# EAGLE design LB_BIT_i37_mix_v03(3_5) (EAGLE 6.6.0)
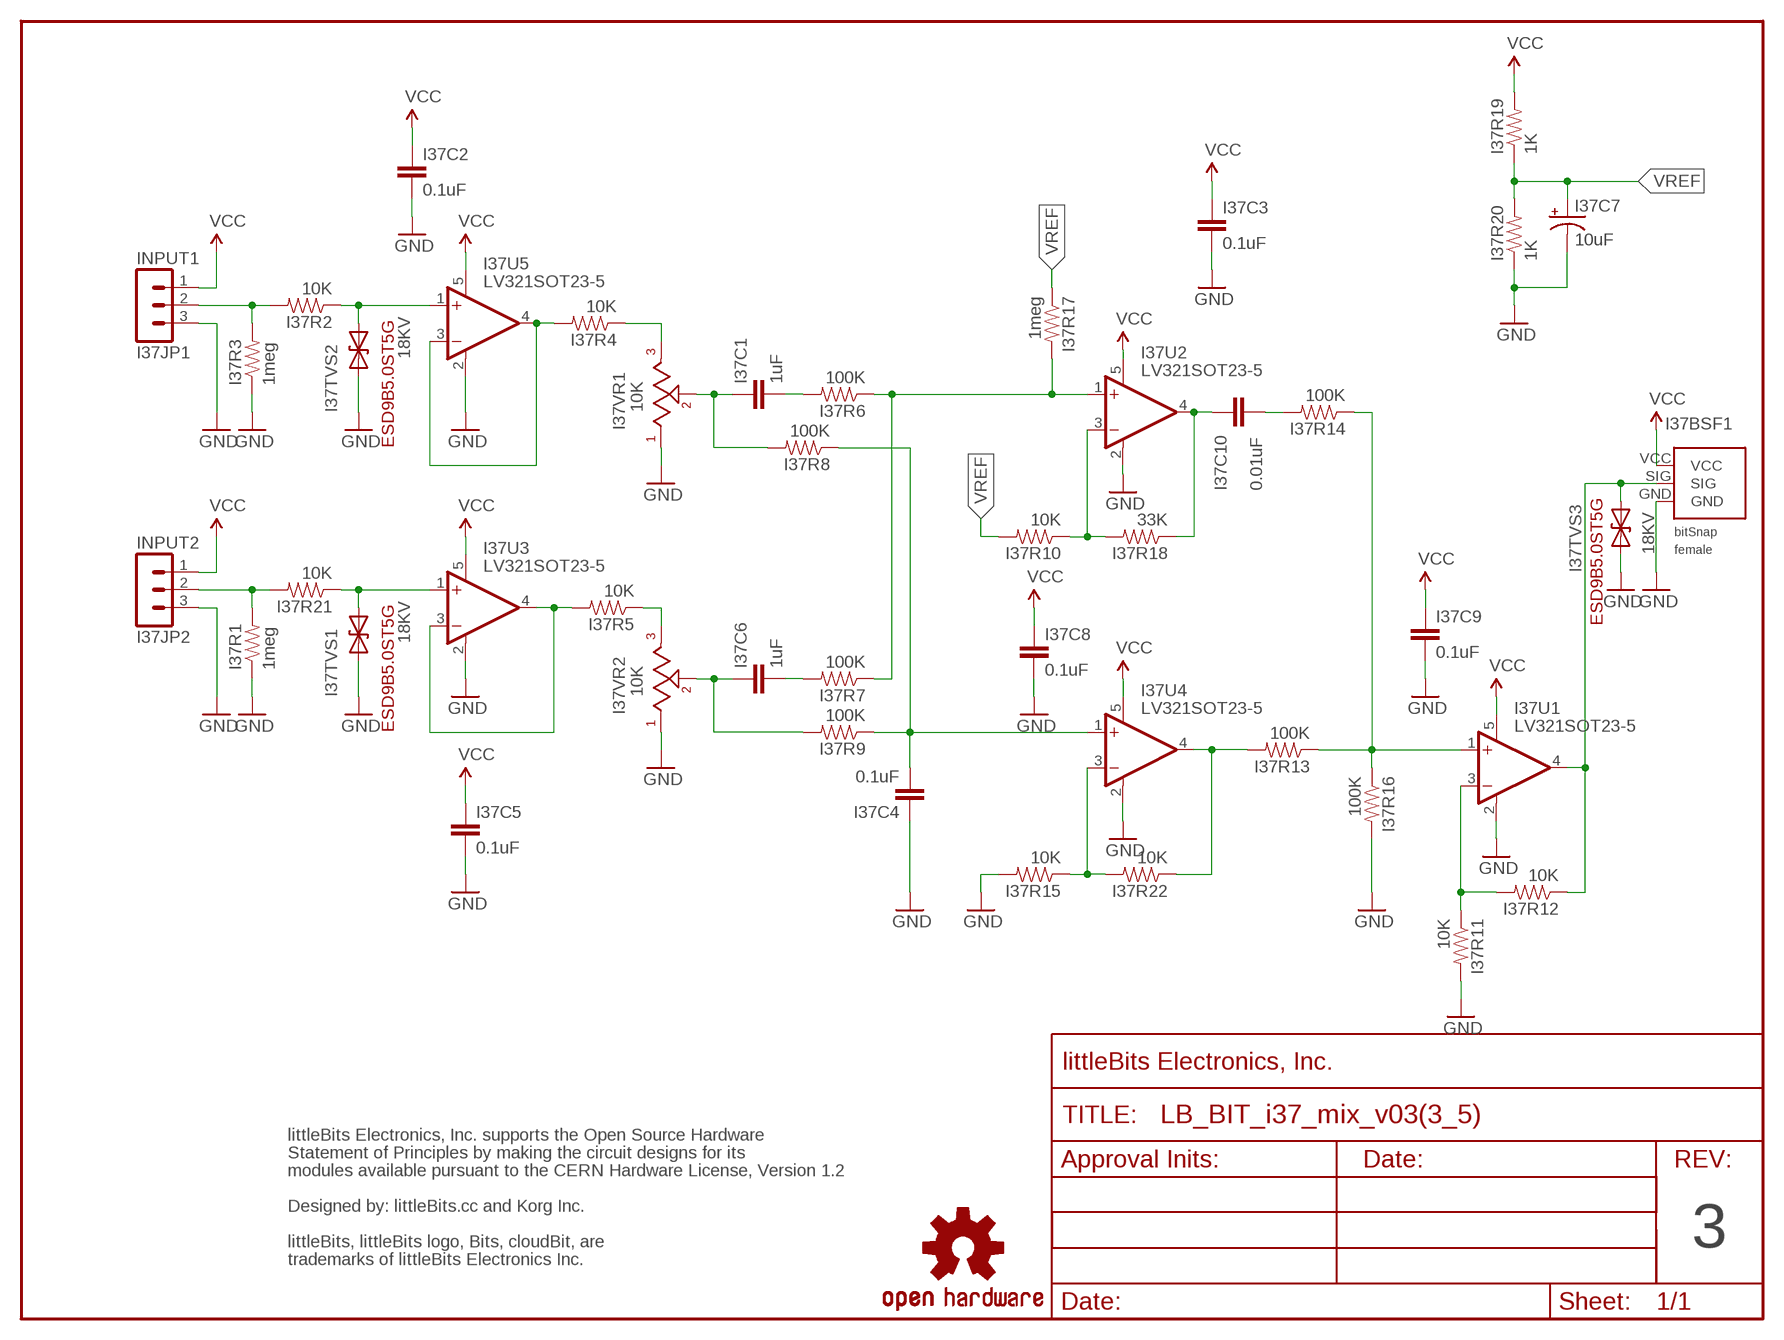
[diagram p0: schematic, sheet 1]

## Parts
I37BSF1  BITSNAP_V03_FEMALE  [BITSNAP_V03_FEMALE]
I37C1  1uF  CAPCAP-0603  [CAP-0603]
I37C2  0.1uF  CAPCAP-0603  [CAP-0603]
I37C3  0.1uF  CAPCAP-0603  [CAP-0603]
I37C4  0.1uF  CAPCAP-0603  [CAP-0603]
I37C5  0.1uF  CAPCAP-0603  [CAP-0603]
I37C6  1uF  CAPCAP-0603  [CAP-0603]
I37C7  10uF  CAP_POL3216  [EIA3216]
I37C8  0.1uF  CAPCAP-0603  [CAP-0603]
I37C9  0.1uF  CAPCAP-0603  [CAP-0603]
I37C10  0.01uF  CAPCAP-0603  [CAP-0603]
I37JP1  INPUT1  MA03-1SMD  [1X03-1MM-RA]
I37JP2  INPUT2  MA03-1SMD  [1X03-1MM-RA]
I37R1  1meg  RESISTOR0603  [RES-0603]
I37R2  10K  RESISTOR0603  [RES-0603]
I37R3  1meg  RESISTOR0603  [RES-0603]
I37R4  10K  RESISTOR0603  [RES-0603]
I37R5  10K  RESISTOR0603  [RES-0603]
I37R6  100K  RESISTOR0603  [RES-0603]
I37R7  100K  RESISTOR0603  [RES-0603]
I37R8  100K  RESISTOR0603  [RES-0603]
I37R9  100K  RESISTOR0603  [RES-0603]
I37R10  10K  RESISTOR0603  [RES-0603]
I37R11  10K  RESISTOR0603  [RES-0603]
I37R12  10K  RESISTOR0603  [RES-0603]
I37R13  100K  RESISTOR0603  [RES-0603]
I37R14  100K  RESISTOR0603  [RES-0603]
I37R15  10K  RESISTOR0603  [RES-0603]
I37R16  100K  RESISTOR0603  [RES-0603]
I37R17  1meg  RESISTOR0603  [RES-0603]
I37R18  33K  RESISTOR0603  [RES-0603]
I37R19  1K  RESISTOR0603  [RES-0603]
I37R20  1K  RESISTOR0603  [RES-0603]
I37R21  10K  RESISTOR0603  [RES-0603]
I37R22  10K  RESISTOR0603  [RES-0603]
I37TVS1  18KV  DIODE-TVSSOD-923  [SOD-923]
I37TVS2  18KV  DIODE-TVSSOD-923  [SOD-923]
I37TVS3  18KV  DIODE-TVSSOD-923  [SOD-923]
I37U1  LV321SOT23-5  [SOT23-5]
I37U2  LV321SOT23-5  [SOT23-5]
I37U3  LV321SOT23-5  [SOT23-5]
I37U4  LV321SOT23-5  [SOT23-5]
I37U5  LV321SOT23-5  [SOT23-5]
I37VR1  10K  ALPS_POTTH  [ALPS_POT]
I37VR2  10K  ALPS_POTTH  [ALPS_POT]
U$1  OSHWCREDIT-KORG  [OSHWCREDIT-KORG]
U$2  FRAME-LETTER-OHWOHW  [FABDWG01-OHW]
U$19  OSHW-LOGOL  [OSHW-LOGO-L]

## Nets
GND: I37BSF1.GND I37C2.2 I37C3.2 I37C4.1 I37C5.2 I37C7.- I37C8.2 I37C9.2 I37JP1.3 I37JP2.3 I37R1.1 I37R3.1 I37R11.2 I37R15.2 I37R16.2 I37R20.1 I37TVS1.1(A) I37TVS2.1(A) I37TVS3.1(A) I37U1.2(V-) I37U2.2(V-) I37U3.2(V-) I37U4.2(V-) I37U5.2(V-) I37VR1.1 I37VR2.1
N$1: I37JP2.2 I37R1.2 I37R21.2
N$2: I37R5.2 I37U3.3(-IN) I37U3.4(OUT)
N$3: I37JP1.2 I37R2.2 I37R3.2
N$4: I37R21.1 I37TVS1.2(C) I37U3.1(+IN)
N$5: I37R4.1 I37VR1.3
N$6: I37R2.1 I37TVS2.2(C) I37U5.1(+IN)
N$7: I37R4.2 I37U5.3(-IN) I37U5.4(OUT)
N$8: I37C1.1 I37R8.2 I37VR1.2
N$9: I37R5.1 I37VR2.3
N$10: I37C6.1 I37R9.2 I37VR2.2
N$11: I37C6.2 I37R7.2
N$12: I37C1.2 I37R6.2
N$13: I37C4.2 I37R8.1 I37R9.1 I37U4.1(+IN)
N$14: I37R6.1 I37R7.1 I37R17.2 I37U2.1(+IN)
N$15: I37R10.1 I37R18.2 I37U2.3(-IN)
N$16: I37C10.1 I37R18.1 I37U2.4(OUT)
N$17: I37R15.1 I37R22.2 I37U4.3(-IN)
N$18: I37R13.2 I37R22.1 I37U4.4(OUT)
N$19: I37R13.1 I37R14.1 I37R16.1 I37U1.1(+IN)
N$20: I37R11.1 I37R12.2 I37U1.3(-IN)
N$21: I37BSF1.SIG I37R12.1 I37TVS3.2(C) I37U1.4(OUT)
N$22: I37C10.2 I37R14.2
VCC: I37BSF1.VCC I37C2.1 I37C3.1 I37C5.1 I37C8.1 I37C9.1 I37JP1.1 I37JP2.1 I37R19.2 I37U1.5(V+) I37U2.5(V+) I37U3.5(V+) I37U4.5(V+) I37U5.5(V+)
VREF: I37C7.+ I37R10.2 I37R17.1 I37R19.1 I37R20.2

## Notes on the sheet
- 3

## Library data of the parts
I37BSF1 = bitSnap:BITSNAP_V03_FEMALE
I37C1-I37C6 I37C8-I37C10 = LITTLEBITS:CAP
I37C7 = LITTLEBITS:CAP_POL
I37JP1 I37JP2 = LITTLEBITS:MA03-1: PIN HEADER
I37R1-I37R22 = LITTLEBITS:RESISTOR
I37TVS1-I37TVS3 = LITTLEBITS:DIODE-TVS: Bidirectional Transient Voltage Suppression Diode: Device conducts in avalanche mode after reaching a part dependent voltage threshold. Used for limiting voltage spikes on ESD sensitive inputs and outputs.; IEC_ESD_PROT0: +/-18kV; LB_PN: ?; MPN: ESD9B5.0ST5G; V_CLAMP: ?; V_OPERATION: 5V
I37U1-I37U5 = LITTLEBITS:LV321
I37VR1 I37VR2 = LITTLEBITS:ALPS_POT
U$1 = LITTLEBITS:OSHWCREDIT-KORG
U$2 = LITTLEBITS:FRAME-LETTER-OHW
U$19 = SparkFun_NEW:OSHW-LOGO: Open Source Hardware Logo This logo indicates the piece of hardware it is found on incorporates a OSHW license and/or adheres to the definition of open source hardware found here: http://freedomdefined.org/OSHW

## Board
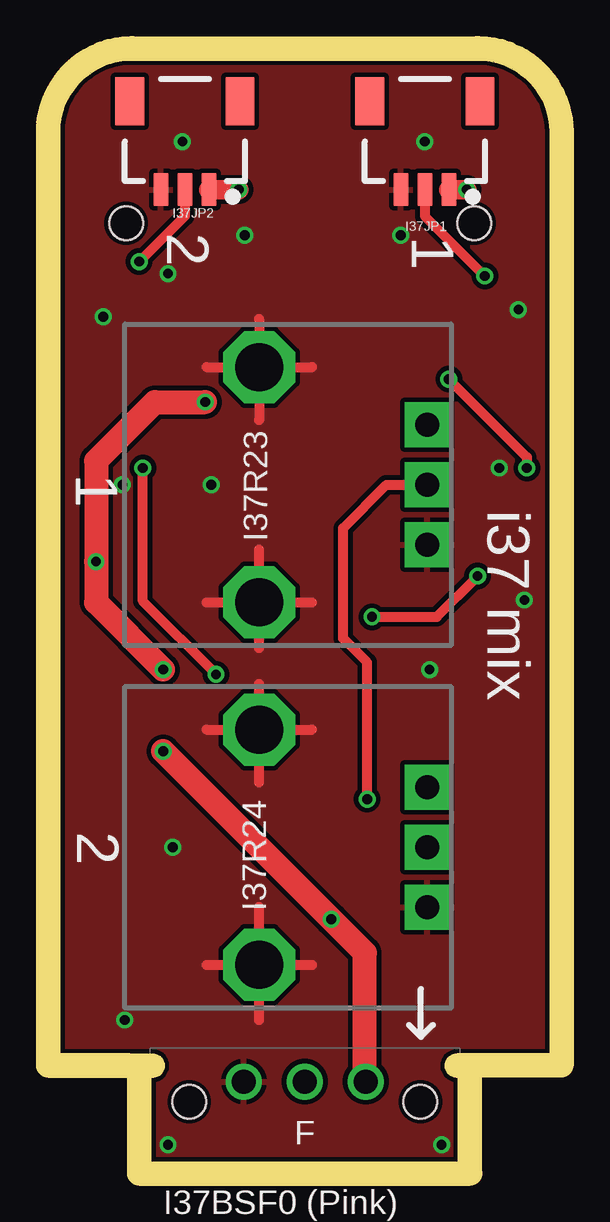
[diagram p1: board, top side]
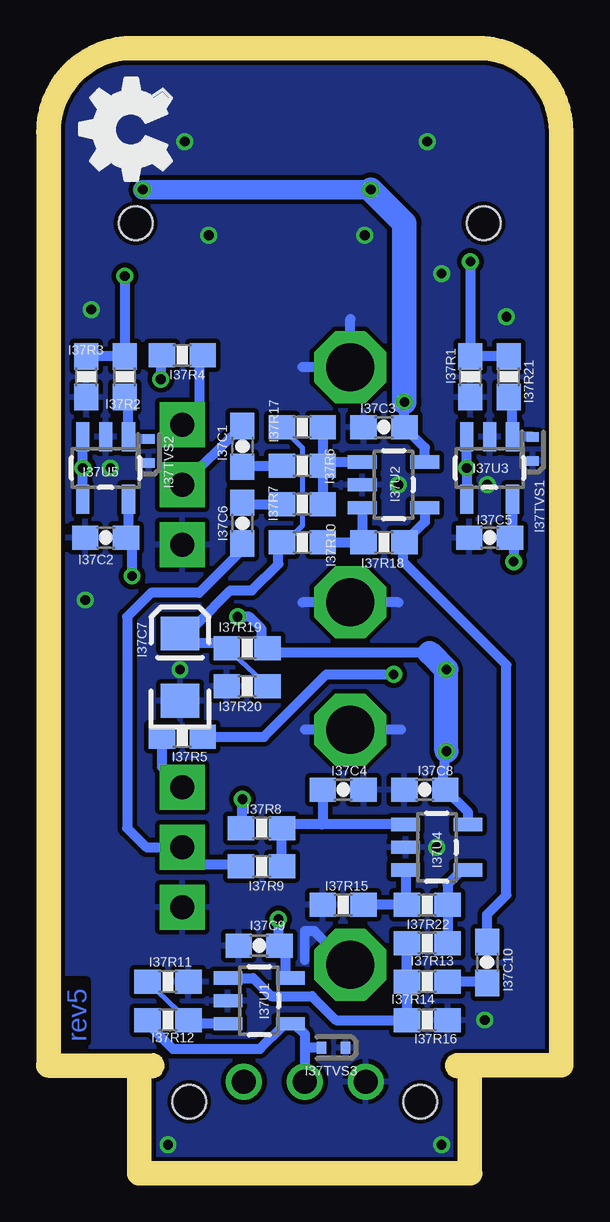
[diagram p2: board, bottom side, seen from below]

Size 20.4 x 45.9 mm. Coordinates in mm from the lower left corner, seen from the top.
Outline: 2.9,4.5 0,4.5 0,42.9 arc-90 3,45.9 17.4,45.9 arc-90 20.4,42.9 20.4,4.5
Copper layers (1*16): Top 0.035mm / dielectric 1.5mm / Bottom 0.035mm
Design rules "littleBitsDRC": minimum track width 0.2mm, minimum drill 0.4mm, track to track 0.2mm, track to pad 0.2mm, pad to pad 0.2mm, via to via 0.2mm, smd to smd 0mil, copper to edge 0.2mm, drill to drill 0.2mm, minimum pad ring 0.2mm, minimum via ring 0.15mm, stop-mask expansion 0.1mm, vias tented up to drill 0mil, thermal gap 0.2mm
Milling: 7 lines

### Footprints (pad centres in the part's own frame; a part is rotated, then mirrored left to right if it is on the bottom)
BITSNAP_V03_FEMALE = drill 1: GND 3.91,3.33; SIG 6.45,3.33; VCC 8.99,3.33 | hole 1.4: 1.63,2.5; 11.27,2.5
CAP-0603 = smd 1.1 x 1: 1 -0.85,0; 2 0.85,0
EIA3216 = smd 1.4 x 1.6: + 1.4,0; - -1.4,0
1X03-1MM-RA = smd 0.6 x 1.35: 1 -1,0; 2 0,0; 3 1,0 | smd 1.2 x 2: NC1 2.3,-3.675; NC2 -2.3,-3.675
RES-0603 = smd 1.1 x 1: 1 -0.85,0; 2 0.85,0
SOD-923 = smd 0.4 x 0.5: 1 -0.5,0; 2 0.5,0
SOT23-5 = smd 0.55 x 1.2: 1 -0.95,-1.3; 2 0,-1.3; 3 0.95,-1.3; 4 0.95,1.3; 5 -0.95,1.3
ALPS_POT = drill 1 pad 1.88 square: 1 7,-2.5; 2 7,0; 3 7,2.5 | drill 2 octagon: LUG1 0,-4.9; LUG2 0,4.9
LB_PWR_LEGS = hole 1.4: 2.75,4.4; 17.25,4.4

### Placement (x,y rotation side)
I37BSF1  3.75,0 0 top
I37C1  12.8,29.8 270 bottom
I37C2  18.5,26 180 bottom
I37C3  6.9,30.6 180 bottom
I37C4  8.6,15.5 180 bottom
I37C5  2.5,26 180 bottom
I37C6  12.8,26.6 90 bottom
I37C7  15.4,20.6 90 bottom
I37C8  5.2,15.5 180 bottom
I37C9  12.1,9 180 bottom
I37C10  2.6,8.3 270 bottom
I37JP1  15.2,40.5 180 top
I37JP2  5.2,40.5 180 top
I37R1  3.3,32.7 90 bottom
I37R2  17.7,32.7 90 bottom
I37R3  19.3,32.7 90 bottom
I37R4  15.3,33.6 180 bottom
I37R5  15.3,17.7 0 bottom
I37R6  10.3,29 180 bottom
I37R7  10.3,27.4 180 bottom
I37R8  12,13.9 180 bottom
I37R9  12,12.3 180 bottom
I37R10  10.3,25.8 180 bottom
I37R11  15.9,7.5 0 bottom
I37R12  15.9,5.9 0 bottom
I37R13  5.1,9.1 0 bottom
I37R14  5.1,7.5 0 bottom
I37R15  8.6,10.7 180 bottom
I37R16  5.1,5.9 0 bottom
I37R17  10.3,30.6 0 bottom
I37R18  6.9,25.8 180 bottom
I37R19  12.6,21.4 0 bottom
I37R20  12.6,19.8 0 bottom
I37R21  1.7,32.7 90 bottom
I37R22  5.1,10.7 180 bottom
I37TVS1  0.7,29.7 90 bottom
I37TVS2  16.7,29.6 90 bottom
I37TVS3  9,4.75 180 bottom
I37U1  12.1,6.7 270 bottom
I37U2  6.5,28.2 270 bottom
I37U3  2.5,28.9 180 bottom
I37U4  4.7,13.1 270 bottom
I37U5  18.5,28.9 180 bottom
I37VR1  8.3,28.2 0 top
I37VR2  8.3,13.1 0 top
U$1  -76.35,-70.9 0 top  (outside the outline)
U$2  0,0 0 top
U$5  [LB_PWR_LEGS]  0,34.7 0 top
U$8  [OSHW_FILLX150_NOTEXT]  15.76,40.06 0 top
U$19  -24.5,-71.59 0 top  (outside the outline)

### Tracks (layer width: path | path; a pad name or v marks a point on that pad's centre or on a via)
GND  (via drill 0.41)
  Top 0.406: 8.3,35.1 8.3,30.9 | 6.1,33.1 10.5,33.1 | 6.1,23.3 10.5,23.3 | 8.3,21.4 8.3,25.5 | 6.1,18 10.5,18 | 8.3,15.8 8.3,19.9 | 6.1,8.2 10.5,8.2 | 8.3,5.9 8.3,10.6
  Bottom 0.4: 10.2,9.6 10.2,8.4
  Bottom 0.406: 7.2,33.1 10.3,33.1 | 6.3,23.3 10.3,23.3 | 6.2,18 10.2,18 | 7.3,8.2 8.4,8.2 9.8,9.6 10.2,9.6 | 8.3,32 8.3,35.1
  other vias: 15.4,20.5 6.3,28.2 4.7,13.1 15.9,0.7 4.5,0.7 5.1,42.5 15.2,42.5 14.2,38.6 7.7,38.6 4.5,37 1.8,35.2 18.3,28.9 2.6,28.2 2.7,5.9 19.35,23.4 19.1,35.5
  pour Top: 0,0 0,45.9 20.4,45.9 20.4,0
  pour Bottom: 0,0 0,45.9 20.4,45.9 20.4,0
N$1  (via drill 0.41)
  Top 0.406: I37JP2.2 5.2,39.4 v3.3,37.5
  Bottom 0.406: I37R21.2 I37R1.2 v3.3,37.5
N$2  (via drill 0.41)
  Top 0.406: v6.5,20.3 3.45,23.35 v3.45,28.9
  Bottom 0.406: I37U3.3 v3.45,28.9 I37U3.4 | 3.5,27.5 I37U3.4 | I37U3.4 | I37R5.2 11.9,17.7 9.3,20.3 v6.5,20.3
N$3  (via drill 0.41)
  Top 0.406: I37JP1.2 15.2,39.4 v17.7,36.9
  Bottom 0.406: I37R3.2 I37R2.2 v17.7,36.9
N$4
  Bottom 0.406: I37TVS1.2 | I37TVS1.2 I37U3.1 1.55,31.85 I37R21.1
N$5
  Bottom 0.406: I37R4.1 14.6,33.4 14.6,31.3 14.9,31 I37VR1.3
N$6
  Bottom 0.406: I37TVS2.2 17.45,30.1 I37U5.1 17.55,31.7 I37R2.1
N$7  (via drill 0.41)
  Top 0.406: v16.2,32.6 19.45,29.35 v19.45,28.9
  Bottom 0.406: I37U5.4 v19.45,28.9 I37U5.3 | I37R4.2 16.2,33.5 v16.2,32.6
N$8  (via drill 0.41)
  Top 0.406: v12.8,15.1 12.8,20.8 11.8,21.8 11.8,26.4 13.6,28.2 I37VR1.2
  Bottom 0.406: I37VR1.2 14.5,29 I37C1.1 | I37R8.2 12.8,14.05 v12.8,15.1
N$9
  Bottom 0.406: I37VR2.3 16.15,16.45 I37R5.1
N$10
  Bottom 0.406: I37R9.2 13.1,12.4 15,12.4 15.3,12.7 I37VR2.2 16.8,13.1 17.6,13.9 17.6,22.7 16.6,23.7 14.6,23.7 12.6,25.7 13,25.7 I37C6.1
N$11
  Bottom 0.406: I37C6.2 12.7,27.4 I37R7.2
N$12
  Bottom 0.406: I37C1.2 12.7,29 I37R6.2
N$13
  Bottom 0.406: I37R9.1 I37R8.1 11,14.05 9.5,14.05 | I37U4.1 9.5,14.05 | I37C4.2 9.45,14.1 arc90 9.5,14.05
N$14
  Bottom 0.406: I37R17.2 I37R7.1 | I37R6.1 I37R7.1 | I37U2.1 9.45,29.15 I37R7.1
N$15
  Bottom 0.406: I37R10.1 I37R18.2 7.8,25.8 I37U2.3
N$16
  Bottom 0.406: I37U2.4 5.2,26.65 I37R18.1 6.1,25.8 6.1,25 1.8,20.7 1.8,11.1 2.6,10.3 I37C10.1
N$17
  Bottom 0.406: I37R15.1 I37R22.2 6,10.75 I37U4.3
N$18
  Bottom 0.406: I37U4.4 3.7,12.15 3.7,12.1 4.25,11.55 I37R22.1 I37R13.2
N$19
  Bottom 0.406: I37R14.1 I37R13.1 I37R16.1 8.9,5.9 9.9,6.9 11.6,6.9 12.35,7.65 I37U1.1
N$20
  Bottom 0.2: I37R11.1 I37R12.2
  Bottom 0.406: I37U1.3 15.1,5.75 I37R12.2
N$21
  Bottom 0.2: 10.23,3.33 I37BSF1.SIG 10.13,3.3 10.2,3.4
  Bottom 0.406: 10.2,4.7 10.2,4.9 10.2,5.3 10.65,5.75 I37U1.4 11.1,5.67 12.07,4.7 15.7,4.7 16.75,5.75 I37R12.1 | 10.2,4.7 10.2,3.4 | I37TVS3.2 10.15,4.75 10.2,4.7
N$22
  Bottom 0.406: I37C10.2 2.5,7.5 I37R14.2
VCC  (via drill 0.41)
  Top 0.406: v13,22.7 15.7,22.7 v17.4,24.4
  Top 0.813: v16.95,40.5 I37JP1.1 | v7.45,40.5 I37JP2.1
  Top 1: I37BSF1.VCC 12.71,3.3 12.7,3.3 12.7,8.7 v11.3,10.1 v4.3,17.1 | v4.3,20.5 1.5,23.3 v1.5,25 1.5,29.2 3.95,31.65 v6.05,31.65
  Bottom 0.406: I37U3.5 1.55,26 I37C5.1 1.5,26 v1.5,25 | I37U4.5 3.4,14.55 I37C8.1 4.5,15.6 v4.3,17.1 | I37C2.1 17.7,25.95 | I37U5.5 17.55,26.1 arc90 I37C2.1 | v6.05,31.65 I37C3.1 5.2,29.75 I37U2.5 | 5,21.2 11.7,21.2 11.7,21.4 I37R19.2 11.8,21.4 arc90 12,21.6 12,22.2 12.5,22.7 v13,22.7 | I37U1.5 11,7.65 11,8.75 I37C9.1 11.3,9.05 v11.3,10.1 | v17.4,24.4 17.4,25.75 I37C2.1
  Bottom 0.813: v7.45,40.5 v16.95,40.5
  Bottom 1: v4.3,17.1 v4.3,20.5 5,21.2
  Bottom 1.016: v6.05,31.65 6.05,39.1 v7.45,40.5
VREF
  Bottom 0.2: I37R20.2 I37R19.1 | I37R17.1 10.3,29.75 10.3,26.5 11,25.8
  Bottom 0.406: I37R19.1 13.65,21.6 14.9,21.6 15.5,22.1 | 11,25.8 I37R10.2 11.3,25.6 11.3,24.9 12.4,23.8 13.3,23.8 14.7,22.4 15.4,22.4 15.5,22.1 | 15.5,22.1 I37C7.+

### Text on the board
Bottom: rev5
tPlace: 2 | 1 | 1 | i37 mix | 2
tNames: I37R23 | I37R24 | I37BSF0 (Pink)
Milling: 1mm DIA. ROUTER PATH
Reference: XL
dxf: 5 | Mixer Bit